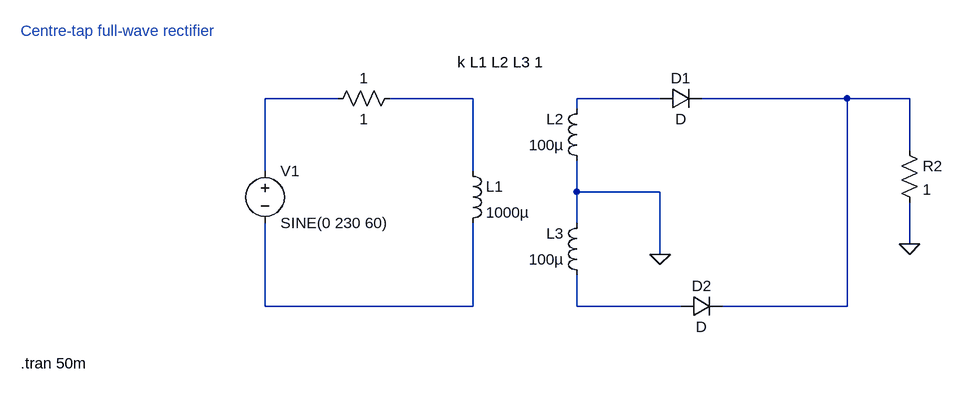
[diagram p0: schematic ntre-tap full-wave rectifier.asc]
ntre-tap full-wave rectifier.asc, the LTspice schematic file:
Version 4.1
SHEET 1 1464 680
WIRE 528 176 416 176
WIRE 736 176 608 176
WIRE 1024 176 896 176
WIRE 1312 176 1088 176
WIRE 1408 176 1312 176
WIRE 896 192 896 176
WIRE 1408 256 1408 176
WIRE 416 288 416 176
WIRE 736 288 736 176
WIRE 896 320 896 272
WIRE 1024 320 896 320
WIRE 896 368 896 320
WIRE 1408 400 1408 336
WIRE 1024 416 1024 320
WIRE 416 496 416 368
WIRE 736 496 736 368
WIRE 736 496 416 496
WIRE 896 496 896 448
WIRE 1056 496 896 496
WIRE 1312 496 1312 176
WIRE 1312 496 1120 496
FLAG 1408 400 0
FLAG 1024 416 0
SYMBOL voltage 416 272 R0
WINDOW 123 0 0 Left 0
WINDOW 39 0 0 Left 0
SYMATTR InstName V1
SYMATTR Value SINE(0 230 60)
SYMBOL res 624 160 R90
WINDOW 0 0 56 VBottom 2
WINDOW 3 32 56 VTop 2
SYMATTR InstName 1
SYMATTR Value 1
SYMBOL ind 720 272 R0
SYMATTR InstName L1
SYMATTR Value 1000µ
SYMATTR Type ind
SYMBOL ind 912 288 R180
WINDOW 0 36 80 Left 2
WINDOW 3 36 40 Left 2
SYMATTR InstName L2
SYMATTR Value 100µ
SYMATTR Type ind
SYMBOL ind 912 464 R180
WINDOW 0 36 80 Left 2
WINDOW 3 36 40 Left 2
SYMATTR InstName L3
SYMATTR Value 100µ
SYMATTR Type ind
SYMBOL diode 1024 192 R270
WINDOW 0 32 32 VTop 2
WINDOW 3 0 32 VBottom 2
SYMATTR InstName D1
SYMBOL diode 1056 512 R270
WINDOW 0 32 32 VTop 2
WINDOW 3 0 32 VBottom 2
SYMATTR InstName D2
SYMBOL res 1392 240 R0
SYMATTR InstName R2
SYMATTR Value 1
TEXT 40 72 Left 2 ;Centre-tap full-wave rectifier
TEXT 712 120 Left 2 !k L1 L2 L3 1
TEXT 40 584 Left 2 !.tran 50m

The netlist it stands for:
* ntre-tap full-wave rectifier.asc
V1 N001 N005 SINE(0 230 60)
R§1 N002 N001 1
L1 N002 N005 1000µ
L2 0 N003 100µ
L3 N006 0 100µ
D1 N003 N004 D
D2 N006 N004 D
R2 N004 0 1
.model D D
.lib standard.dio
* Centre-tap full-wave rectifier
k L1 L2 L3 1
.tran 50m
.backanno
.end